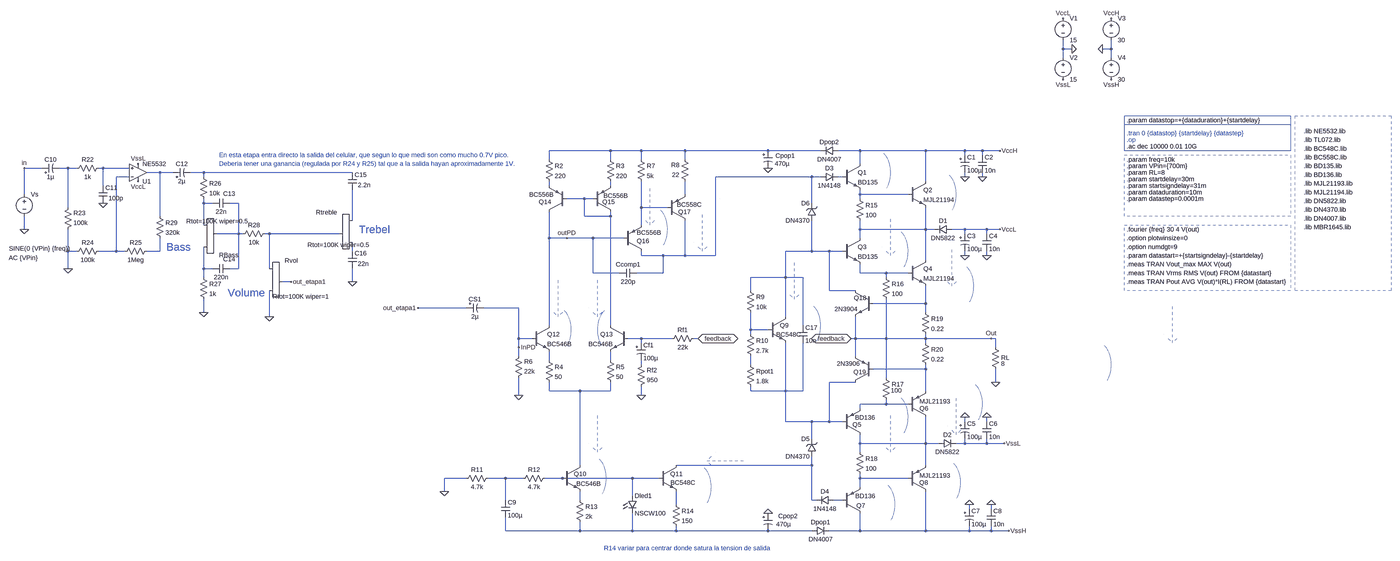
[diagram p0: schematic circuito_completo.asc, whole sheet]
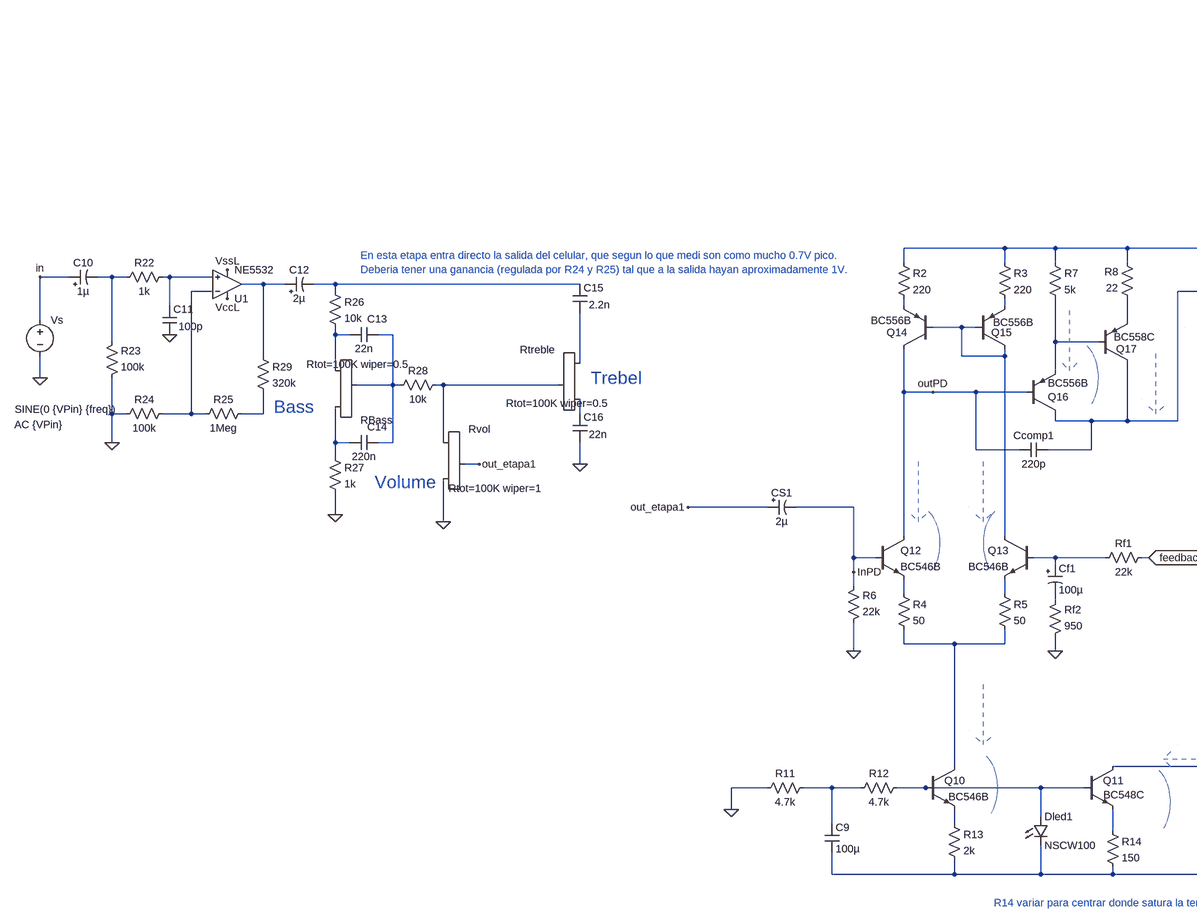
[diagram p1: schematic circuito_completo.asc, part, row 1 of 1, column 1 of 2]
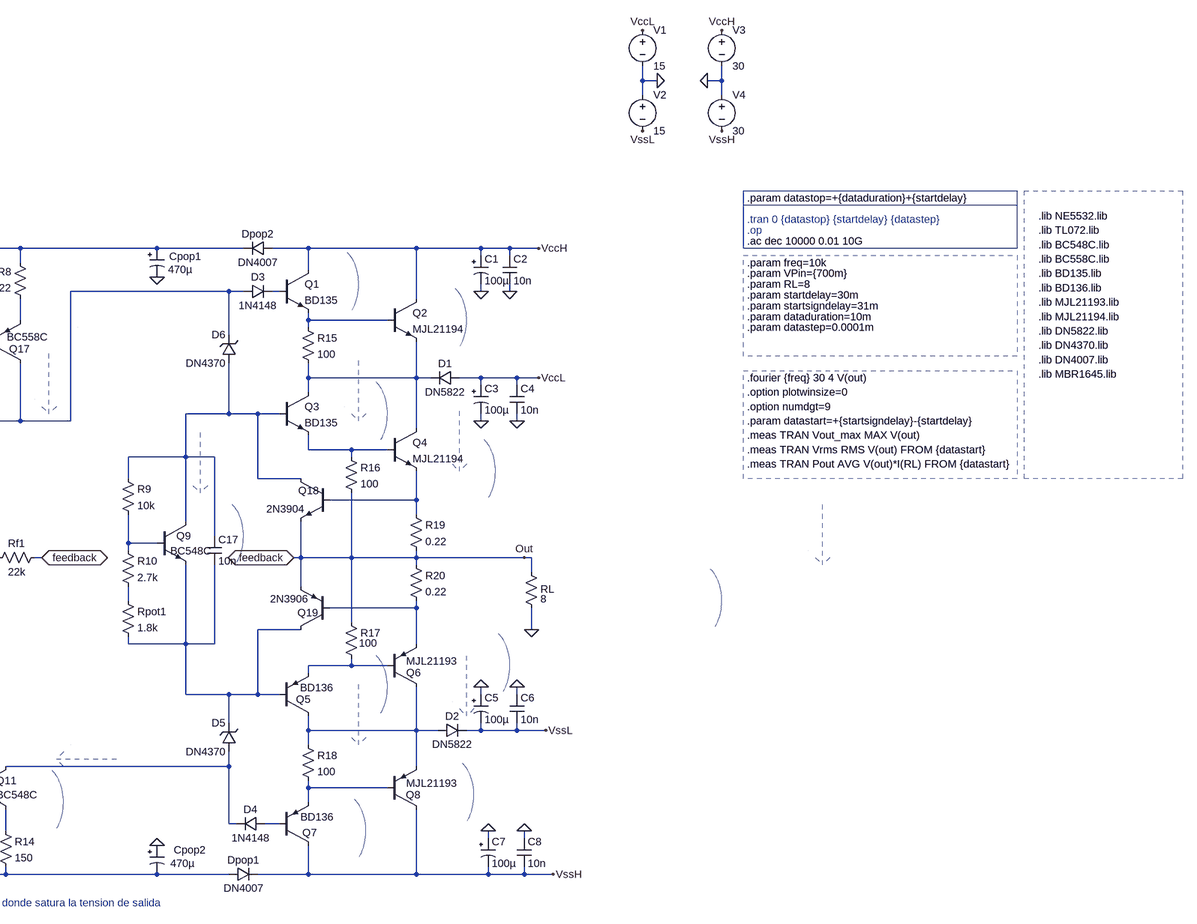
[diagram p2: schematic circuito_completo.asc, part, row 1 of 1, column 2 of 2]
circuito_completo.asc, the LTspice schematic file:
Version 4
SHEET 1 4372 1548
WIRE 3088 -608 3088 -640
WIRE 3120 -608 3088 -608
WIRE 3264 -608 3264 -640
WIRE 3264 -608 3232 -608
WIRE 3088 -576 3088 -608
WIRE 3264 -576 3264 -608
WIRE 1328 -80 1104 -80
WIRE 1440 -80 1328 -80
WIRE 1600 -80 1440 -80
WIRE 1904 -80 1600 -80
WIRE 2096 -80 1904 -80
WIRE 2240 -80 2160 -80
WIRE 2480 -80 2240 -80
WIRE 2624 -80 2480 -80
WIRE 2688 -80 2624 -80
WIRE 2752 -80 2688 -80
WIRE 2624 -64 2624 -80
WIRE 2688 -64 2688 -80
WIRE 1104 -48 1104 -80
WIRE 1328 -48 1328 -80
WIRE 1440 -48 1440 -80
WIRE 1600 -48 1600 -80
WIRE 2240 -32 2240 -80
WIRE -752 -16 -816 -16
WIRE -656 -16 -688 -16
WIRE -624 -16 -656 -16
WIRE -528 -16 -544 -16
WIRE -432 -16 -528 -16
WIRE -320 0 -368 0
WIRE -272 0 -320 0
WIRE -160 0 -208 0
WIRE 384 0 -160 0
WIRE -432 16 -480 16
WIRE -160 16 -160 0
WIRE 2064 16 1712 16
WIRE 2096 16 2064 16
WIRE 2176 16 2160 16
WIRE 2624 16 2624 0
WIRE 2688 16 2688 0
WIRE 2480 32 2480 -80
WIRE -528 48 -528 -16
WIRE 1104 48 1104 32
WIRE 1328 48 1328 32
WIRE -816 80 -816 -16
WIRE 1600 80 1600 32
WIRE 2240 80 2240 64
WIRE 2416 80 2240 80
WIRE 1232 96 1168 96
WIRE 1264 96 1232 96
WIRE 2240 96 2240 80
WIRE -160 112 -160 96
WIRE -128 112 -160 112
WIRE -32 112 -64 112
WIRE 2064 112 2064 16
WIRE -656 128 -656 -16
WIRE 1440 128 1440 32
WIRE 1536 128 1440 128
WIRE -320 160 -320 0
WIRE 1232 160 1232 96
WIRE 1328 160 1328 144
WIRE 1328 160 1232 160
WIRE 384 176 384 64
WIRE -160 192 -160 112
WIRE 1440 192 1440 128
WIRE -816 208 -816 160
WIRE 2240 208 2240 176
WIRE 2480 208 2480 128
WIRE 2480 208 2240 208
WIRE 2512 208 2480 208
WIRE 2624 208 2576 208
WIRE 2704 208 2624 208
WIRE 2752 208 2704 208
WIRE -32 224 -32 112
WIRE -32 224 -112 224
WIRE -16 224 -32 224
WIRE 80 224 64 224
WIRE 336 224 80 224
WIRE 2624 224 2624 208
WIRE 2704 224 2704 208
WIRE 1104 240 1104 144
WIRE 1168 240 1104 240
WIRE 1264 240 1168 240
WIRE 1376 240 1264 240
WIRE 2240 240 2240 208
WIRE -656 288 -656 208
WIRE -624 288 -656 288
WIRE -480 288 -480 16
WIRE -480 288 -544 288
WIRE -448 288 -480 288
WIRE -320 288 -320 240
WIRE -320 288 -368 288
WIRE 384 288 384 256
WIRE 2064 288 2064 176
WIRE 2064 288 1968 288
WIRE 2128 288 2064 288
WIRE 2176 288 2128 288
WIRE 1440 304 1440 288
WIRE 1520 304 1440 304
WIRE 1600 304 1600 176
WIRE 1600 304 1520 304
WIRE 1712 304 1712 16
WIRE 1712 304 1600 304
WIRE 2624 304 2624 288
WIRE 2704 304 2704 288
WIRE 2480 320 2480 208
WIRE -656 352 -656 288
WIRE -160 352 -160 272
WIRE -128 352 -160 352
WIRE -32 352 -32 224
WIRE -32 352 -64 352
WIRE 80 352 80 224
WIRE 1264 368 1264 240
WIRE 1360 368 1264 368
WIRE 1520 368 1520 304
WIRE 1520 368 1424 368
WIRE 2240 368 2240 336
WIRE 2336 368 2240 368
WIRE 2416 368 2336 368
WIRE -160 384 -160 352
WIRE 1968 384 1968 288
WIRE 1968 384 1840 384
WIRE 2032 384 1968 384
WIRE 2336 384 2336 368
WIRE 160 400 128 400
WIRE 384 400 384 352
WIRE 1840 432 1840 384
WIRE 2128 432 2128 288
WIRE 2224 432 2128 432
WIRE 2480 480 2480 416
WIRE 2480 480 2288 480
WIRE 800 496 624 496
WIRE 992 496 864 496
WIRE -160 512 -160 464
WIRE 2480 512 2480 480
WIRE 80 528 80 432
WIRE 1968 528 1968 384
WIRE 1104 560 1104 240
WIRE 1328 560 1328 160
WIRE 2032 560 2032 384
WIRE 1840 576 1840 512
WIRE 1904 576 1840 576
WIRE 1840 592 1840 576
WIRE 992 608 992 496
WIRE 1040 608 992 608
WIRE 1440 608 1392 608
WIRE 1552 608 1440 608
WIRE 1648 608 1632 608
WIRE 2224 608 2224 528
WIRE 2224 608 2208 608
WIRE 2336 608 2336 464
WIRE 2336 608 2224 608
WIRE 2480 608 2480 592
WIRE 2480 608 2336 608
WIRE 2720 608 2480 608
WIRE 2736 608 2720 608
WIRE 1440 624 1440 608
WIRE 2480 624 2480 608
WIRE 992 640 992 608
WIRE 2736 640 2736 608
WIRE 992 672 992 640
WIRE 2224 672 2224 608
WIRE 1104 688 1104 656
WIRE 1328 688 1328 656
WIRE 1440 704 1440 688
WIRE 1840 704 1840 672
WIRE 2480 720 2480 704
WIRE 2480 720 2288 720
WIRE 2336 752 2336 608
WIRE 2224 768 2128 768
WIRE 2736 768 2736 720
WIRE 1104 800 1104 768
WIRE 1216 800 1104 800
WIRE 1328 800 1328 768
WIRE 1328 800 1216 800
WIRE 1840 800 1840 784
WIRE 1968 800 1968 624
WIRE 1968 800 1840 800
WIRE 2032 800 2032 624
WIRE 2032 800 1968 800
WIRE 2480 800 2480 720
WIRE 992 816 992 752
WIRE 1440 816 1440 784
WIRE 2336 848 2336 832
WIRE 2336 848 2240 848
WIRE 2416 848 2336 848
WIRE 2240 864 2240 848
WIRE 1968 912 1968 800
WIRE 2064 912 1968 912
WIRE 2128 912 2128 768
WIRE 2128 912 2064 912
WIRE 2176 912 2128 912
WIRE 2624 912 2624 896
WIRE 2704 912 2704 896
WIRE 2064 976 2064 912
WIRE 2240 992 2240 960
WIRE 2480 992 2480 896
WIRE 2480 992 2240 992
WIRE 2528 992 2480 992
WIRE 2624 992 2624 976
WIRE 2624 992 2592 992
WIRE 2704 992 2704 976
WIRE 2704 992 2624 992
WIRE 2768 992 2704 992
WIRE 2240 1024 2240 992
WIRE 1216 1072 1216 800
WIRE 2064 1072 2064 1040
WIRE 2064 1072 1568 1072
WIRE 2480 1072 2480 992
WIRE 800 1120 720 1120
WIRE 944 1120 880 1120
WIRE 1008 1120 944 1120
WIRE 1152 1120 1088 1120
WIRE 1408 1120 1152 1120
WIRE 1504 1120 1408 1120
WIRE 2240 1120 2240 1104
WIRE 2416 1120 2240 1120
WIRE 2240 1152 2240 1120
WIRE 720 1168 720 1120
WIRE 1408 1184 1408 1120
WIRE 944 1200 944 1120
WIRE 1216 1200 1216 1168
WIRE 2064 1200 2064 1072
WIRE 2080 1200 2064 1200
WIRE 2176 1200 2144 1200
WIRE 1568 1216 1568 1168
WIRE 2640 1232 2640 1216
WIRE 2720 1232 2720 1216
WIRE 944 1312 944 1264
WIRE 1216 1312 1216 1280
WIRE 1216 1312 944 1312
WIRE 1408 1312 1408 1248
WIRE 1408 1312 1216 1312
WIRE 1568 1312 1568 1296
WIRE 1568 1312 1408 1312
WIRE 1904 1312 1568 1312
WIRE 2064 1312 1904 1312
WIRE 2240 1312 2240 1248
WIRE 2240 1312 2128 1312
WIRE 2480 1312 2480 1168
WIRE 2480 1312 2240 1312
WIRE 2640 1312 2640 1296
WIRE 2640 1312 2480 1312
WIRE 2720 1312 2720 1296
WIRE 2720 1312 2640 1312
WIRE 2784 1312 2720 1312
FLAG 3120 -608 0
FLAG 3232 -608 0
FLAG 3264 -720 VccH
FLAG 3088 -720 VccL
FLAG 3264 -496 VssH
FLAG 3088 -496 VssL
FLAG -816 208 0
FLAG -160 512 0
FLAG -656 352 0
FLAG -400 32 VccL
FLAG -400 -32 VssL
FLAG -528 112 0
FLAG 80 528 0
FLAG 384 400 0
FLAG 160 400 out_etapa1
FLAG -816 -16 in
FLAG 2752 208 VccL
FLAG 2752 -80 VccH
FLAG 2736 768 0
FLAG 2784 1312 VssH
FLAG 2720 608 Out
FLAG 1440 816 0
FLAG 992 816 0
FLAG 2768 992 VssL
FLAG 992 640 InPD
FLAG 1904 -16 0
FLAG 1904 1248 0
FLAG 2624 896 0
FLAG 2640 1216 0
FLAG 2624 304 0
FLAG 2624 16 0
FLAG 2688 16 0
FLAG 2720 1216 0
FLAG 2704 304 0
FLAG 2704 896 0
FLAG 1168 240 outPD
FLAG 624 496 out_etapa1
FLAG 2208 608 feedback
IOPIN 2208 608 BiDir
FLAG 1648 608 feedback
IOPIN 1648 608 BiDir
FLAG 720 1168 0
DATAFLAG 2576 320 "Ic(Q4)"
DATAFLAG 2592 864 "-Ic(Q6)"
DATAFLAG 2624 608 ""
DATAFLAG 1008 608 ""
DATAFLAG 1472 608 ""
DATAFLAG 1776 1056 "Ic(Q11)"
DATAFLAG 1584 1072 ""
DATAFLAG 1984 288 ""
DATAFLAG 1984 912 ""
DATAFLAG 3488 528 "-Ix(Q3:3)"
DATAFLAG 2592 80 "V(VccH,N018)"
DATAFLAG 3264 704 "V(VccH,N018)"
DATAFLAG 2656 416 "V(N018,N025)"
DATAFLAG 2688 848 "V(N032,N036)"
DATAFLAG 2608 1136 "V(N036,VssH)"
DATAFLAG 2000 368 "Ic(Q9)"
DATAFLAG 1664 192 "-Ic(Q17)"
DATAFLAG 1104 320 ""
DATAFLAG 2352 208 "Ic(Q3)"
DATAFLAG 2352 928 "-Ic(Q5)"
DATAFLAG 1184 576 "V(outPD,N028)"
DATAFLAG 1280 544 "V(N013,N029)"
DATAFLAG 1280 928 "Ic(Q10)"
DATAFLAG 1136 432 "Ic(Q12)"
DATAFLAG 1280 432 "Ic(Q13)"
DATAFLAG 2352 0 "V(VccH,N012)"
DATAFLAG 2416 288 "V(N018,N024)"
DATAFLAG 2416 896 "V(N035,N036)"
DATAFLAG 2368 1216 "V(N040,VssH)"
DATAFLAG 2096 560 "V(N022,N033)"
DATAFLAG 1696 1152 "V(N037,N043)"
DATAFLAG 1312 1120 "V(N034,N041)"
DATAFLAG 1536 208 "V(N016,N007)"
DATAFLAG 1472 96 "Ie(Q16)"
DATAFLAG 1440 128 ""
SYMBOL voltage 3088 -736 R0
WINDOW 123 0 0 Left 0
WINDOW 39 0 0 Left 0
SYMATTR InstName V1
SYMATTR Value 15
SYMBOL voltage 3088 -592 R0
WINDOW 123 0 0 Left 0
WINDOW 39 0 0 Left 0
SYMATTR InstName V2
SYMATTR Value 15
SYMBOL voltage 3264 -736 R0
WINDOW 123 0 0 Left 0
WINDOW 39 0 0 Left 0
SYMATTR InstName V3
SYMATTR Value 30
SYMBOL voltage 3264 -592 R0
WINDOW 123 0 0 Left 0
WINDOW 39 0 0 Left 0
SYMATTR InstName V4
SYMATTR Value 30
SYMBOL polcap -752 0 R270
WINDOW 0 32 32 VTop 2
WINDOW 3 0 32 VBottom 2
SYMATTR InstName C10
SYMATTR Value 1µ
SYMBOL polcap -272 16 R270
WINDOW 0 32 32 VTop 2
WINDOW 3 0 32 VBottom 2
SYMATTR InstName C12
SYMATTR Value 2µ
SYMBOL res -528 -32 R90
WINDOW 0 0 56 VBottom 2
WINDOW 3 32 56 VTop 2
SYMATTR InstName R22
SYMATTR Value 1k
SYMBOL res -672 224 M180
WINDOW 0 36 76 Left 2
WINDOW 3 36 40 Left 2
SYMATTR InstName R23
SYMATTR Value 100k
SYMBOL res -640 304 R270
WINDOW 0 32 56 VTop 2
WINDOW 3 0 56 VBottom 2
SYMATTR InstName R24
SYMATTR Value 100k
SYMBOL res -464 304 R270
WINDOW 0 32 56 VTop 2
WINDOW 3 0 56 VBottom 2
SYMATTR InstName R25
SYMATTR Value 1Meg
SYMBOL res -176 0 R0
SYMATTR InstName R26
SYMATTR Value 10k
SYMBOL res -176 368 R0
SYMATTR InstName R27
SYMATTR Value 1k
SYMBOL res 80 208 R90
WINDOW 0 0 56 VBottom 2
WINDOW 3 32 56 VTop 2
SYMATTR InstName R28
SYMATTR Value 10k
SYMBOL voltage -816 64 R0
WINDOW 123 -57 248 Left 2
WINDOW 39 0 0 Left 0
WINDOW 3 -56 214 Left 2
SYMATTR Value2 AC {VPin}
SYMATTR Value SINE(0 {VPin} {freq})
SYMATTR InstName Vs
SYMBOL Opamps\\opamp2 -400 64 M180
SYMATTR InstName U1
SYMATTR Value NE5532
SYMATTR SpiceModel NE5532
SYMBOL res 2720 624 R0
WINDOW 0 36 54 Left 2
SYMATTR InstName RL
SYMATTR Value 8
SYMBOL diode 2096 32 R270
WINDOW 0 32 32 VTop 2
WINDOW 3 0 32 VBottom 2
SYMATTR InstName D3
SYMATTR Value 1N4148
SYMBOL diode 2144 1184 R90
WINDOW 0 0 32 VBottom 2
WINDOW 3 32 32 VTop 2
SYMATTR InstName D4
SYMATTR Value 1N4148
SYMBOL npn 1904 528 R0
WINDOW 0 43 32 Left 2
WINDOW 3 30 65 Left 2
SYMATTR InstName Q9
SYMATTR Value BC548C
SYMBOL res 1824 416 R0
SYMATTR InstName R9
SYMATTR Value 10k
SYMBOL res 1824 576 R0
SYMATTR InstName R10
SYMATTR Value 2.7k
SYMBOL npn 1504 1072 R0
WINDOW 0 42 32 Left 2
WINDOW 3 43 64 Left 2
SYMATTR InstName Q11
SYMATTR Value BC548C
SYMBOL res 1552 1200 R0
SYMATTR InstName R14
SYMATTR Value 150
SYMBOL npn 1392 560 M0
SYMATTR InstName Q13
SYMATTR Value BC546B
SYMBOL res 1648 592 R90
WINDOW 0 0 56 VBottom 2
WINDOW 3 32 56 VTop 2
SYMATTR InstName Rf1
SYMATTR Value 22k
SYMBOL res 1424 800 M180
WINDOW 0 36 76 Left 2
WINDOW 3 36 40 Left 2
SYMATTR InstName Rf2
SYMATTR Value 950
SYMBOL npn 1040 560 R0
SYMATTR InstName Q12
SYMATTR Value BC546B
SYMBOL npn 1152 1072 R0
WINDOW 0 42 32 Left 2
WINDOW 3 51 68 Left 2
SYMATTR InstName Q10
SYMATTR Value BC546B
SYMBOL res 1200 1184 R0
SYMATTR InstName R13
SYMATTR Value 2k
SYMBOL res 1104 1104 R90
WINDOW 0 0 56 VBottom 2
WINDOW 3 32 56 VTop 2
SYMATTR InstName R12
SYMATTR Value 4.7k
SYMBOL res 976 768 M180
WINDOW 0 36 76 Left 2
WINDOW 3 36 40 Left 2
SYMATTR InstName R6
SYMATTR Value 22k
SYMBOL res 784 1136 R270
WINDOW 0 32 56 VTop 2
WINDOW 3 0 56 VBottom 2
SYMATTR InstName R11
SYMATTR Value 4.7k
SYMBOL cap 928 1200 R0
SYMATTR InstName C9
SYMATTR Value 100µ
SYMBOL pnp 1168 144 R180
WINDOW 0 57 37 Left 2
WINDOW 3 48 63 Left 2
SYMATTR InstName Q14
SYMATTR Value BC556B
SYMBOL pnp 1264 144 M180
WINDOW 0 34 37 Left 2
WINDOW 3 38 59 Left 2
SYMATTR InstName Q15
SYMATTR Value BC556B
SYMBOL res 1424 -64 R0
SYMATTR InstName R7
SYMATTR Value 5k
SYMBOL pnp 1376 288 M180
WINDOW 0 48 37 Left 2
WINDOW 3 48 68 Left 2
SYMATTR InstName Q16
SYMATTR Value BC556B
SYMBOL zener 2080 1040 R180
WINDOW 0 24 64 Left 2
WINDOW 3 24 0 Left 2
SYMATTR InstName D5
SYMATTR Value DN4370
SYMBOL zener 2080 176 R180
WINDOW 0 24 64 Left 2
WINDOW 3 24 0 Left 2
SYMATTR InstName D6
SYMATTR Value DN4370
SYMBOL LED 1392 1184 R0
SYMATTR InstName Dled1
SYMATTR Value NSCW100
SYMBOL res 1616 48 R180
WINDOW 0 36 76 Left 2
WINDOW 3 36 40 Left 2
SYMATTR InstName R8
SYMATTR Value 22
SYMBOL pnp 1536 176 M180
WINDOW 0 39 32 Left 2
WINDOW 3 34 59 Left 2
SYMATTR InstName Q17
SYMATTR Value BC558C
SYMBOL cap 1424 352 R90
WINDOW 0 0 32 VBottom 2
WINDOW 3 32 32 VTop 2
SYMATTR InstName Ccomp1
SYMATTR Value 220p
SYMBOL diode 2064 1328 R270
WINDOW 0 32 32 VTop 2
WINDOW 3 0 32 VBottom 2
SYMATTR InstName Dpop1
SYMATTR Value DN4007
SYMBOL diode 2160 -96 R90
WINDOW 0 0 32 VBottom 2
WINDOW 3 32 32 VTop 2
SYMATTR InstName Dpop2
SYMATTR Value DN4007
SYMBOL res 1088 -64 R0
SYMATTR InstName R2
SYMATTR Value 220
SYMBOL res 1312 -64 R0
SYMATTR InstName R3
SYMATTR Value 220
SYMBOL cap 2672 -64 R0
SYMATTR InstName C2
SYMATTR Value 10n
SYMBOL cap 2704 1232 R0
SYMATTR InstName C8
SYMATTR Value 10n
SYMBOL cap 2688 288 M180
WINDOW 0 24 56 Left 2
WINDOW 3 24 8 Left 2
SYMATTR InstName C4
SYMATTR Value 10n
SYMBOL cap 2688 976 M180
WINDOW 0 24 56 Left 2
WINDOW 3 24 8 Left 2
SYMATTR InstName C6
SYMATTR Value 10n
SYMBOL diode 2528 1008 R270
WINDOW 0 32 32 VTop 2
WINDOW 3 0 32 VBottom 2
SYMATTR InstName D2
SYMATTR Value DN5822
SYMBOL diode 2576 192 R90
WINDOW 0 0 32 VBottom 2
WINDOW 3 32 32 VTop 2
SYMATTR InstName D1
SYMATTR Value DN5822
SYMBOL npn 2288 432 M0
WINDOW 0 24 27 Left 2
SYMATTR InstName Q18
SYMATTR Value 2N3904
SYMBOL pnp 2288 768 R180
WINDOW 0 26 37 Left 2
WINDOW 3 48 68 Left 2
SYMATTR InstName Q19
SYMATTR Value 2N3906
SYMBOL res 1088 672 R0
SYMATTR InstName R4
SYMATTR Value 50
SYMBOL res 1312 672 R0
SYMATTR InstName R5
SYMATTR Value 50
SYMBOL res 2464 608 R0
SYMATTR InstName R20
SYMATTR Value 0.22
SYMBOL res 2464 496 R0
SYMATTR InstName R19
SYMATTR Value 0.22
SYMBOL npn 2176 240 R0
SYMATTR InstName Q3
SYMATTR Value BD135
SYMBOL npn 2416 320 R0
SYMATTR InstName Q4
SYMATTR Value MJL21194
SYMBOL npn 2176 -32 R0
SYMATTR InstName Q1
SYMATTR Value BD135
SYMBOL npn 2416 32 R0
SYMATTR InstName Q2
SYMATTR Value MJL21194
SYMBOL pnp 2416 896 M180
WINDOW 0 42 32 Left 2
WINDOW 3 42 58 Left 2
SYMATTR InstName Q6
SYMATTR Value MJL21193
SYMBOL pnp 2176 960 M180
WINDOW 0 37 37 Left 2
WINDOW 3 46 63 Left 2
SYMATTR InstName Q5
SYMATTR Value BD136
SYMBOL pnp 2416 1168 M180
WINDOW 0 41 32 Left 2
WINDOW 3 42 58 Left 2
SYMATTR InstName Q8
SYMATTR Value MJL21193
SYMBOL pnp 2176 1248 M180
WINDOW 0 51 28 Left 2
WINDOW 3 47 63 Left 2
SYMATTR InstName Q7
SYMATTR Value BD136
SYMBOL res 2224 1008 R0
SYMATTR InstName R18
SYMATTR Value 100
SYMBOL res 2320 736 R0
WINDOW 3 73 62 Right 2
SYMATTR Value 100
SYMATTR InstName R17
SYMBOL res 2320 368 R0
SYMATTR InstName R16
SYMATTR Value 100
SYMBOL res 2224 80 R0
SYMATTR InstName R15
SYMATTR Value 100
SYMBOL res 1824 688 R0
SYMATTR InstName Rpot1
SYMATTR Value 1.8k
SYMBOL cap 2016 560 R0
SYMATTR InstName C17
SYMATTR Value 10n
SYMBOL res -336 144 R0
SYMATTR InstName R29
SYMATTR Value 320k
SYMBOL polcap 800 480 M90
WINDOW 0 0 32 VBottom 2
WINDOW 3 32 32 VTop 2
SYMATTR InstName CS1
SYMATTR Value 2µ
SYMBOL polcap 1424 624 R0
SYMATTR InstName Cf1
SYMATTR Value 100µ
SYMBOL polcap 1888 -80 R0
WINDOW 0 43 18 Left 2
WINDOW 3 41 47 Left 2
SYMATTR InstName Cpop1
SYMATTR Value 470µ
SYMBOL polcap 1888 1248 R0
WINDOW 0 53 10 Left 2
WINDOW 3 46 40 Left 2
SYMATTR InstName Cpop2
SYMATTR Value 470µ
SYMBOL polcap 2608 -64 R0
SYMATTR InstName C1
SYMATTR Value 100µ
SYMBOL polcap 2624 1232 R0
SYMATTR InstName C7
SYMATTR Value 100µ
SYMBOL polcap 2608 224 R0
SYMATTR InstName C3
SYMATTR Value 100µ
SYMBOL polcap 2608 912 R0
SYMATTR InstName C5
SYMATTR Value 100µ
SYMBOL cap 368 352 M180
WINDOW 0 24 56 Left 2
WINDOW 3 36 18 Left 2
SYMATTR InstName C16
SYMATTR Value 22n
SYMBOL cap -128 96 M90
WINDOW 0 -3 61 VBottom 2
WINDOW 3 32 32 VTop 2
SYMATTR InstName C13
SYMATTR Value 22n
SYMBOL cap -128 336 M90
WINDOW 0 -3 61 VBottom 2
WINDOW 3 32 32 VTop 2
SYMATTR InstName C14
SYMATTR Value 220n
SYMBOL cap -544 112 M180
WINDOW 0 24 56 Left 2
WINDOW 3 36 18 Left 2
SYMATTR InstName C11
SYMATTR Value 100p
SYMBOL cap 368 64 M180
WINDOW 0 24 56 Left 2
WINDOW 3 36 18 Left 2
SYMATTR InstName C15
SYMATTR Value 2.2n
SYMBOL potentiometer_standard -176 288 M180
WINDOW 3 -48 110 Left 2
WINDOW 39 48 112 Invisible 2
SYMATTR Value Rtot=100K wiper=0.5
SYMATTR SpiceLine Rtap=1E-5 tap=0.5
SYMATTR InstName RBass
SYMBOL potentiometer_standard 64 336 R0
WINDOW 3 28 118 Left 2
WINDOW 39 48 112 Invisible 2
SYMATTR Value Rtot=100K wiper=1
SYMATTR SpiceLine Rtap=1E-5 tap=0.5
SYMATTR InstName Rvol
SYMATTR SpiceModel pot_plog
SYMBOL potentiometer_standard 400 160 M0
WINDOW 3 -47 105 Left 2
WINDOW 39 48 112 Invisible 2
SYMATTR Value Rtot=100K wiper=0.5
SYMATTR SpiceLine Rtap=1E-5 tap=0.5
SYMATTR InstName Rtreble
TEXT 3968 -88 Left 2 !.lib BC548C.lib
TEXT 3968 200 Left 2 !.lib MBR1645.lib
TEXT 3968 -120 Left 2 !.lib TL072.lib
TEXT -104 -64 Left 2 ;En esta etapa entra directo la salida del celular, que segun lo que medi son como mucho 0.7V pico.\nDeberia tener una ganancia (regulada por R24 y R25) tal que a la salida hayan aproximadamente 1V.
TEXT 1304 1376 Left 2 ;R14 variar para centrar donde satura la tension de salida
TEXT 3968 136 Left 2 !.lib DN4370.lib
TEXT 3968 40 Left 2 !.lib MJL21193.lib
TEXT 3968 72 Left 2 !.lib MJL21194.lib
TEXT 3968 104 Left 2 !.lib DN5822.lib
TEXT 3968 168 Left 2 !.lib DN4007.lib
TEXT 408 208 Left 4 ;Trebel
TEXT -72 440 Left 4 ;Volume
TEXT -296 272 Left 4 ;Bass
TEXT 3968 -56 Left 2 !.lib BC558C.lib
TEXT 3968 -24 Left 2 !.lib BD135.lib
TEXT 3968 8 Left 2 !.lib BD136.lib
TEXT 3320 208 Left 2 !.fourier {freq} 30 4 V(out)
TEXT 3320 240 Left 2 !.option plotwinsize=0
TEXT 3320 368 Left 2 !.meas TRAN Vrms RMS V(out) FROM {datastart}
TEXT 3320 400 Left 2 !.meas TRAN Pout AVG V(out)*I(RL) FROM {datastart}
TEXT 3320 272 Left 2 !.option numdgt=9
TEXT 3320 336 Left 2 !.meas TRAN Vout_max MAX V(out)
TEXT 3320 304 Left 2 !.param datastart=+{startsigndelay}-{startdelay}
TEXT 3320 -144 Left 2 ;.tran 0 {datastop} {startdelay} {datastep}
TEXT 3320 -48 Left 2 !.param freq=10k
TEXT 3320 -120 Left 2 ;.op
TEXT 3320 -96 Left 2 !.ac dec 10000 0.01 10G
TEXT 3320 -24 Left 2 !.param VPin={700m}
TEXT 3320 0 Left 2 !.param RL=8
TEXT 3320 24 Left 2 !.param startdelay=30m
TEXT 3320 48 Left 2 !.param startsigndelay=31m
TEXT 3320 72 Left 2 !.param dataduration=10m
TEXT 3320 -192 Left 2 !.param datastop=+{dataduration}+{startdelay}
TEXT 3320 96 Left 2 !.param datastep=0.0001m
TEXT 3968 -152 Left 2 !.lib NE5532.lib
LINE Normal 2576 416 2576 272 2
LINE Normal 2576 416 2576 416 2
LINE Normal 2576 416 2576 416 2
LINE Normal 2560 400 2576 416 2
LINE Normal 2560 400 2560 400 2
LINE Normal 2592 400 2576 416 2
LINE Normal 2544 384 2544 384 2
LINE Normal 2592 960 2592 816 2
LINE Normal 2592 960 2592 960 2
LINE Normal 2592 960 2592 960 2
LINE Normal 2576 944 2592 960 2
LINE Normal 2576 944 2576 944 2
LINE Normal 2608 944 2592 960 2
LINE Normal 2560 928 2560 928 2
LINE Normal 3920 -176 3312 -176
LINE Normal 3920 -176 3920 -176 2
LINE Normal 3920 -208 3920 -208 2
LINE Normal 1680 1056 1824 1056 2
LINE Normal 1680 1056 1680 1056 2
LINE Normal 1680 1056 1680 1056 2
LINE Normal 1696 1040 1680 1056 2
LINE Normal 1696 1040 1696 1040 2
LINE Normal 1696 1072 1680 1056 2
LINE Normal 1712 1024 1712 1024 2
LINE Normal 3488 624 3488 480 2
LINE Normal 3488 624 3488 624 2
LINE Normal 3488 624 3488 624 2
LINE Normal 3472 608 3488 624 2
LINE Normal 3472 608 3472 608 2
LINE Normal 3504 608 3488 624 2
LINE Normal 3456 592 3456 592 2
LINE Normal 2000 464 2000 320 2
LINE Normal 2000 464 2000 464 2
LINE Normal 2000 464 2000 464 2
LINE Normal 1984 448 2000 464 2
LINE Normal 1984 448 1984 448 2
LINE Normal 2016 448 2000 464 2
LINE Normal 1968 432 1968 432 2
LINE Normal 1664 288 1664 144 2
LINE Normal 1664 288 1664 288 2
LINE Normal 1664 288 1664 288 2
LINE Normal 1648 272 1664 288 2
LINE Normal 1648 272 1648 272 2
LINE Normal 1680 272 1664 288 2
LINE Normal 1632 256 1632 256 2
LINE Normal 2352 304 2352 160 2
LINE Normal 2352 304 2352 304 2
LINE Normal 2352 304 2352 304 2
LINE Normal 2336 288 2352 304 2
LINE Normal 2336 288 2336 288 2
LINE Normal 2368 288 2352 304 2
LINE Normal 2320 272 2320 272 2
LINE Normal 2352 1024 2352 880 2
LINE Normal 2352 1024 2352 1024 2
LINE Normal 2352 1024 2352 1024 2
LINE Normal 2336 1008 2352 1024 2
LINE Normal 2336 1008 2336 1008 2
LINE Normal 2368 1008 2352 1024 2
LINE Normal 2320 992 2320 992 2
LINE Normal 1280 1024 1280 880 2
LINE Normal 1280 1024 1280 1024 2
LINE Normal 1280 1024 1280 1024 2
LINE Normal 1264 1008 1280 1024 2
LINE Normal 1264 1008 1264 1008 2
LINE Normal 1296 1008 1280 1024 2
LINE Normal 1248 992 1248 992 2
LINE Normal 1136 528 1136 384 2
LINE Normal 1136 528 1136 528 2
LINE Normal 1136 528 1136 528 2
LINE Normal 1120 512 1136 528 2
LINE Normal 1120 512 1120 512 2
LINE Normal 1152 512 1136 528 2
LINE Normal 1104 496 1104 496 2
LINE Normal 1280 528 1280 384 2
LINE Normal 1280 528 1280 528 2
LINE Normal 1280 528 1280 528 2
LINE Normal 1264 512 1280 528 2
LINE Normal 1264 512 1264 512 2
LINE Normal 1296 512 1280 528 2
LINE Normal 1248 496 1248 496 2
LINE Normal 1728 96 1728 96 2
LINE Normal 1472 192 1472 48 2
LINE Normal 1472 192 1472 192 2
LINE Normal 1472 192 1472 192 2
LINE Normal 1456 176 1472 192 2
LINE Normal 1456 176 1456 176 2
LINE Normal 1488 176 1472 192 2
LINE Normal 1440 160 1440 160 2
RECTANGLE Normal 3920 432 3312 192 3
RECTANGLE Normal 3920 -80 3312 -208
RECTANGLE Normal 3920 160 3312 -64 3
RECTANGLE Normal 4288 432 3936 -208 2
ARC Normal 2496 0 2592 160 2590 158 2569 3 2
ARC Normal 3168 624 3264 784 3262 782 3241 627 2
ARC Normal 2560 336 2656 496 2654 494 2633 339 2
ARC Normal 2592 768 2688 928 2686 926 2665 771 2
ARC Normal 2512 1056 2608 1216 2606 1214 2585 1059 2
ARC Normal 1088 496 1184 656 1182 654 1161 499 2
ARC Normal 1376 496 1280 656 1303 499 1282 654 2
ARC Normal 2256 -80 2352 80 2350 78 2329 -77 2
ARC Normal 2320 208 2416 368 2414 366 2393 211 2
ARC Normal 2320 816 2416 976 2414 974 2393 819 2
ARC Normal 2272 1136 2368 1296 2366 1294 2345 1139 2
ARC Normal 2000 480 2096 640 2094 638 2073 483 2
ARC Normal 1600 1072 1696 1232 1694 1230 1673 1075 2
ARC Normal 1216 1040 1312 1200 1310 1198 1289 1043 2
ARC Normal 1440 128 1536 288 1534 286 1513 131 2

The netlist it stands for:
* circuito_completo.asc
V1 VccL 0 15
V2 0 VssL 15
V3 VccH 0 30
V4 0 VssH 30
C10 in N002 1µ
C12 N004 N005 2µ
R22 N003 N002 1k
R23 0 N002 100k
R24 0 N006 100k
R25 N006 N020 1Meg
R26 N005 N014 10k
R27 N023 0 1k
R28 N019 N015 10k
Vs in 0 SINE(0 {VPin} {freq}) AC {VPin}
XU1 N003 N006 VccL VssL N004 NE5532 NE5532  ; pins In+ In- V+ V- OUT
RL feedback 0 8
D3 N007 N008 1N4148
D4 N042 N037 1N4148
Q9 N022 N026 N033 0 BC548C
R9 N022 N026 10k
R10 N026 N031 2.7k
Q11 N037 N039 N043 0 BC548C
R14 N043 N044 150
Q13 N013 N027 N029 0 BC546B
Rf1 feedback N027 22k
Rf2 0 N030 950
Q12 outPD InPD N028 0 BC546B
Q10 N034 N039 N041 0 BC546B
R13 N041 N044 2k
R12 N039 N038 4.7k
R6 0 InPD 22k
R11 0 N038 4.7k
C9 N038 N044 100µ
Q14 outPD N013 N009 0 BC556B
Q15 N013 N013 N010 0 BC556B
R7 N001 N016 5k
Q16 N007 outPD N016 0 BC556B
D5 N037 N033 DN4370
D6 N022 N007 DN4370
Dled1 N039 N044 NSCW100
R8 N011 N001 22
Q17 N007 N016 N011 0 BC558C
Ccomp1 N007 outPD 220p
Dpop1 N044 VssH DN4007
Dpop2 VccH N001 DN4007
R2 N001 N009 220
R3 N001 N010 220
C2 VccH 0 10n
C8 0 VssH 10n
C4 0 VccL 10n
C6 VssL 0 10n
D2 N036 VssL DN5822
D1 VccL N018 DN5822
Q18 N022 N025 feedback 0 2N3904
Q19 N033 N032 feedback 0 2N3906
R4 N028 N034 50
R5 N029 N034 50
R20 feedback N032 0.22
R19 N025 feedback 0.22
Q3 N018 N022 N024 0 BD135
Q4 N018 N024 N025 0 MJL21194
Q1 VccH N008 N012 0 BD135
Q2 VccH N012 N018 0 MJL21194
Q6 N036 N035 N032 0 MJL21193
Q5 N036 N033 N035 0 BD136
Q8 VssH N040 N036 0 MJL21193
Q7 VssH N042 N040 0 BD136
R18 N036 N040 100
R17 feedback N035 100
R16 N024 feedback 100
R15 N012 N018 100
Rpot1 N031 N033 1.8k
C17 N022 N033 10n
R29 N004 N020 320k
CS1 out_etapa1 InPD 2µ
Cf1 N027 N030 100µ
Cpop1 N001 0 470µ
Cpop2 0 N044 470µ
C1 VccH 0 100µ
C7 0 VssH 100µ
C3 VccL 0 100µ
C5 0 VssL 100µ
C16 0 N021 22n
C13 N014 N015 22n
C14 N023 N015 220n
C11 0 N003 100p
C15 N017 N005 2.2n
XRBass N023 N014 N015 Rtot=100K wiper=0.5 Rtap=1E-5 tap=0.5
XRvol N019 0 out_etapa1 pot_plog Rtot=100K wiper=1 Rtap=1E-5 tap=0.5
XRtreble N017 N021 N019 Rtot=100K wiper=0.5 Rtap=1E-5 tap=0.5
.model D D
.lib standard.dio
.model NPN NPN
.model PNP PNP
.lib standard.bjt
.lib BC548C.lib
.lib MBR1645.lib
.lib TL072.lib
* En esta etapa entra directo la salida del celular, que segun lo que medi son como mucho 0.7V pico.
* Deberia tener una ganancia (regulada por R24 y R25) tal que a la salida hayan aproximadamente 1V.
* R14 variar para centrar donde satura la tension de salida
.lib DN4370.lib
.lib MJL21193.lib
.lib MJL21194.lib
.lib DN5822.lib
.lib DN4007.lib
* Trebel
* Volume
* Bass
.lib BC558C.lib
.lib BD135.lib
.lib BD136.lib
.fourier {freq} 30 4 V(out)
.option plotwinsize=0
.meas TRAN Vrms RMS V(out) FROM {datastart}
.meas TRAN Pout AVG V(out)*I(RL) FROM {datastart}
.option numdgt=9
.meas TRAN Vout_max MAX V(out)
.param datastart=+{startsigndelay}-{startdelay}
* .tran 0 {datastop} {startdelay} {datastep}
.param freq=10k
* .op
.ac dec 10000 0.01 10G
.param VPin={700m}
.param RL=8
.param startdelay=30m
.param startsigndelay=31m
.param dataduration=10m
.param datastop=+{dataduration}+{startdelay}
.param datastep=0.0001m
.lib NE5532.lib
.backanno
.end